# Altium project Antenny_v6.PrjPcb (part 2 of 2)

## Sheet 03_PUSHBUTTON.SchDoc
size A; SheetNumber: 3; SheetTotal: 6
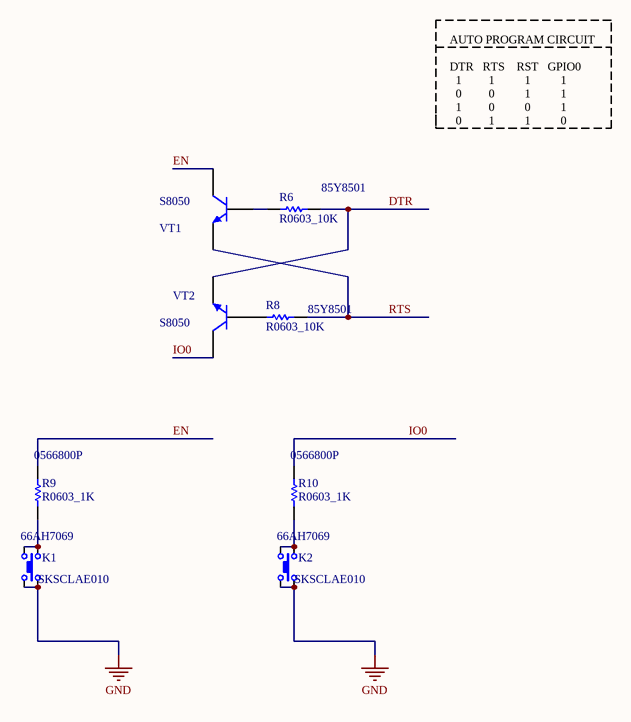
[diagram p2: 03_PUSHBUTTON.SchDoc]

### Parts
K1  SKSCLAE010  Supplier Part Number 1: 66AH7069  [ButtonTACT_3.5*3.55_90]
K2  SKSCLAE010  Supplier Part Number 1: 66AH7069  [ButtonTACT_3.5*3.55_90]
R6  R0603_10K  Supplier Part Number 1: 85Y8501  [RESC1609X55X30LL15T15]
R8  R0603_10K  Supplier Part Number 1: 85Y8501  [RESC1609X55X30LL15T15]
R9  R0603_1K  Supplier Part Number 1: 0566800P  [RESC1609X55X30LL15T15]
R10  R0603_1K  Supplier Part Number 1: 0566800P  [RESC1609X55X30LL15T15]
VT1  S8050  [SMT_TRIODE_NPN]
VT2  S8050  [SMT_TRIODE_NPN]

### Nets
GND: K1.1 K1.3 K2.1 K2.3
DTR: R6.2 VT2.2(E)
EN: R9.2 VT1.3(C)
IO0: R10.2 VT2.3(C)  [project net BOOT_OP0]
RTS: R8.2 VT1.2(E)
NetK1_2: K1.2 K1.4 R9.1
NetK2_2: K2.2 K2.4 R10.1
NetR6_1: R6.1 VT1.1(B)
NetR8_1: R8.1 VT2.1(B)

### Notes on the sheet
- AUTO PROGRAM CIRCUIT
  DTR   RTS    RST   GPIO0
  1         1          1          1
  0         0          1          1
  1         0          0          1
  0         1          1          0

### Library data of the parts
K1 K2 = ButtonTACT: Black Button Tactile Switch, Single Pole Single Throw (SPST) 50 mA 0.65mm Surface Mount; Manufacturer: Alps Electric; value: 3.4x3.5; Operating Force: 2.2N; Max Voltage Rating (DC): 12V; Max Current Rating: 50mA; Contact Resistance: 100mR; Electrical Life: 100000Cycles; type: TACT 4P; Supplier 1: Newark; Manufacturer Part Number: SKSCLAE010; RoHS: Yes; Category: Tactile Switches; Stock 1: 4920; Pricing 1: 10=0.89600, 25=0.76800, 50=0.68700, 100=0.62100 (USD); Mount: Surface Mount; Case/Package: SMD/SMT; Contact Plating: Silver; Min Operating Temperature: -30°C; Max Operating Temperature: 85°C; Throw Configuration: SPST; Termination: Gull Wing; Packaging: Tape and Reel; Voltage Rating (DC): 12V; Current Rating: 50mA; Orientation: Right Angle; Series: SKSC; Length: 4.85mm; Depth: 3.85mm; Actuator Length: 0.65mm; Radiation Hardening: No; Lead Free: Lead Free; RoHS Compliant: Yes; ComponentLink1URL: https://datasheet.ciiva.com/16156/sksc-16156198.pdf?src-supplier=Onlinecomponents.com; ComponentLink1Description: https://datasheet.ciiva.com/16156/sksc-16156198.pdf?src-supplier=Onlinecomponents.com
R6 R8 = R0603: PANASONIC - ERJ-3EKF1002V. - THICK FILM CHIP RES, 0603, 1%, PRECISION; Resistance: 10kR; Power Rating: 100mW; Temperature Coefficient: 100ppm/°C; Voltage Rating: 75V; Supplier 1: Newark; Manufacturer: Panasonic; Manufacturer Part Number: ERJ-3EKF1002V; RoHS: Yes; Category: Chip SMD Resistors; Stock 1: 27295001; Pricing 1: 5000=0.00900, 10000=0.00900 (USD); Mount: Surface Mount; Case/Package: 0603; Number of Pins: 2; Case Code (Metric): 1608; Case Code (Imperial): 0603; Contact Plating: Tin; Size Code: 0603; Min Operating Temperature: -55°C; Max Operating Temperature: 155°C; Packaging: Tape and Reel; Resistor Type: Thick Film; Number of Terminations: 2; Max Power Dissipation: 100mW; Tolerance: 1%; Series: ERJ; Construction: Rectangular; Features: Automotive AEC-Q200; Package Quantity: 1; Voltage Rating (DC): 75V; Termination: SMD/SMT; Resistance Tolerance: 1%; Technology: THICK FILM; Length: 1.6mm; Width: 0.031inch; Height: 0.45mm; Depth: 0.8mm; Radiation Hardening: No; Military Standard: Not; Lead Free: Lead Free; RoHS Compliant: Yes; REACH SVHC: No SVHC; ComponentLink1URL: https://datasheet.ciiva.com/48530/aoa0000ce2-48530988.pdf?src-supplier=Avnet; ComponentLink1Description: https://datasheet.ciiva.com/48530/aoa0000ce2-48530988.pdf?src-supplier=Avnet; ComponentLink2URL: https://datasheet.ciiva.com/24070/aoa0000ce2-24070318.pdf?src-supplier=Mouser; ComponentLink2Description: https://datasheet.ciiva.com/24070/aoa0000ce2-24070318.pdf?src-supplier=Mouser; ComponentLink3URL: https://datasheet.ciiva.com/9194/aoa0000ce2-9194199.pdf?src-supplier=Avnet; ComponentLink3Description: https://datasheet.ciiva.com/9194/aoa0000ce2-9194199.pdf?src-supplier=Avnet; ComponentLink4URL: https://datasheet.ciiva.com/30208/aoa0000ce2-30208985.pdf?src-supplier=Onlinecomponents.com; ComponentLink4Description: https://datasheet.ciiva.com/30208/aoa0000ce2-30208985.pdf?src-supplier=Onlinecomponents.com; ComponentLink5URL: https://datasheet.ciiva.com/16759/70260748-16759807.pdf?src-supplier=Allied+Electronics; ComponentLink5Description: https://datasheet.ciiva.com/16759/70260748-16759807.pdf?src-supplier=Allied+Electronics; ComponentLink6URL: https://datasheet.ciiva.com/7830/aoa0000ce2-7830729.pdf?src-supplier=Element14; ComponentLink6Description: https://datasheet.ciiva.com/7830/aoa0000ce2-7830729.pdf?src-supplier=Element14; ComponentLink7URL: https://datasheet.ciiva.com/28514/426256-28514198.pdf?src-supplier=Element14; ComponentLink7Description: https://datasheet.ciiva.com/28514/426256-28514198.pdf?src-supplier=Element14; ComponentLink8URL: https://datasheet.ciiva.com/46372/1678782-46372725.pdf?src-supplier=Element14; ComponentLink8Description: https://datasheet.ciiva.com/46372/1678782-46372725.pdf?src-supplier=Element14; ComponentLink9URL: https://datasheet.ciiva.com/16511/aoa0000ce2-16511861.pdf?src-supplier=Avnet+Asia; ComponentLink9Description: https://datasheet.ciiva.com/16511/aoa0000ce2-16511861.pdf?src-supplier=Avnet+Asia; ComponentLink10URL: https://datasheet.ciiva.com/17212/aoa0000ce2-17212105.pdf?src-supplier=Avnet+Europe; ComponentLink10Description: https://datasheet.ciiva.com/17212/aoa0000ce2-17212105.pdf?src-supplier=Avnet+Europe
R9 R10 = R0603: Res Thin Film 0603 1K Ohm 0.1% 1/10W ±25ppm/°C Molded SMD SMD Punched Carrier T/R; Manufacturer: Panasonic; Manufacturer Part Number: ERA-3AEB102V; Resistance: 1kR; Power Rating: 100mW; Voltage Rating: 75V; Supplier 1: RSComponents; RoHS: Yes; Category: Chip SMD Resistors; Stock 1: 1; Pricing 1: 5=0.38700, 50=0.32600, 250=0.12700, 1250=0.06600, 2500=0.04700 (USD); Mount: Surface Mount; Case/Package: 0603; Number of Pins: 2; Case Code (Imperial): 0603; Case Code (Metric): 1608; Contact Plating: Tin; Size Code: 0603; Min Operating Temperature: -55°C; Max Operating Temperature: 155°C; Packaging: Tape and Reel; Resistor Type: Thin Film; Temperature Coefficient: 25ppm/°C; Series: ERA-3A; Construction: Rectangular; Tolerance: 0.1%; Number of Terminations: 2; Max Power Dissipation: 100mW; Termination: SMD/SMT; Package Quantity: 5000; Resistance Tolerance: 0.1%; Technology: METAL FILM; Length: 1.6mm; Width: 0.8mm; Height: 0.45mm; Depth: 0.8mm; Radiation Hardening: No; Military Standard: Not; RoHS Compliant: Yes; REACH SVHC: No SVHC; ComponentLink1URL: https://datasheet.ciiva.com/11808/0900766b80fe20f7-11808019.pdf?src-supplier=RSComponents; ComponentLink1Description: https://datasheet.ciiva.com/11808/0900766b80fe20f7-11808019.pdf?src-supplier=RSComponents; ComponentLink2URL: https://datasheet.ciiva.com/29183/450752-da-01-en-widerstand-0603-era-29183754.pdf?src-supplier=Conrad; ComponentLink2Description: https://datasheet.ciiva.com/29183/450752-da-01-en-widerstand-0603-era-29183754.pdf?src-supplier=Conrad; ComponentLink3URL: https://datasheet.ciiva.com/5734/aoa0000ce26-5734524.pdf?src-supplier=Farnell; ComponentLink3Description: https://datasheet.ciiva.com/5734/aoa0000ce26-5734524.pdf?src-supplier=Farnell; ComponentLink4URL: https://datasheet.ciiva.com/5734/485442-5734525.pdf?src-supplier=Farnell; ComponentLink4Description: https://datasheet.ciiva.com/5734/485442-5734525.pdf?src-supplier=Farnell; ComponentLink5URL: https://datasheet.ciiva.com/9198/aoa0000ce26-9198972.pdf?src-supplier=Avnet; ComponentLink5Description: https://datasheet.ciiva.com/9198/aoa0000ce26-9198972.pdf?src-supplier=Avnet; ComponentLink6URL: https://datasheet.ciiva.com/48530/era-eng-tds-48530582.pdf?src-supplier=Distrelec; ComponentLink6Description: https://datasheet.ciiva.com/48530/era-eng-tds-48530582.pdf?src-supplier=Distrelec; ComponentLink7URL: https://datasheet.ciiva.com/24071/aoa0000ce26-197354-24071510.pdf?src-supplier=Mouser; ComponentLink7Description: https://datasheet.ciiva.com/24071/aoa0000ce26-197354-24071510.pdf?src-supplier=Mouser; ComponentLink8URL: https://datasheet.ciiva.com/16853/aoa0000ce26-16853231.pdf?src-supplier=Avnet+Europe; ComponentLink8Description: https://datasheet.ciiva.com/16853/aoa0000ce26-16853231.pdf?src-supplier=Avnet+Europe; ComponentLink9URL: https://datasheet.ciiva.com/16426/aoa0000ce26-16426809.pdf?src-supplier=Future+Electronics; ComponentLink9Description: https://datasheet.ciiva.com/16426/aoa0000ce26-16426809.pdf?src-supplier=Future+Electronics; ComponentLink10URL: https://datasheet.ciiva.com/46393/1776116-46393695.pdf?src-supplier=Element14; ComponentLink10Description: https://datasheet.ciiva.com/46393/1776116-46393695.pdf?src-supplier=Element14; ComponentLink11URL: https://datasheet.ciiva.com/46422/1776116-46422455.pdf?src-supplier=Element14; ComponentLink11Description: https://datasheet.ciiva.com/46422/1776116-46422455.pdf?src-supplier=Element14; ComponentLink12URL: https://datasheet.ciiva.com/46422/485442-46422519.pdf?src-supplier=Element14; ComponentLink12Description: https://datasheet.ciiva.com/46422/485442-46422519.pdf?src-supplier=Element14; ComponentLink13URL: https://datasheet.ciiva.com/28531/485442-28531944.pdf?src-supplier=Element14; ComponentLink13Description: https://datasheet.ciiva.com/28531/485442-28531944.pdf?src-supplier=Element14; ComponentLink14URL: https://datasheet.ciiva.com/16781/70068849-16781703.pdf?src-supplier=Allied+Electronics; ComponentLink14Description: https://datasheet.ciiva.com/16781/70068849-16781703.pdf?src-supplier=Allied+Electronics; ComponentLink15URL: https://datasheet.ciiva.com/16725/70068849-16725038.pdf?src-supplier=Allied+Electronics; ComponentLink15Description: https://datasheet.ciiva.com/16725/70068849-16725038.pdf?src-supplier=Allied+Electronics
VT1 VT2 = SMT_TRIODE_NPN: Surface mount NPN transistor, package SOT-23

## Sheet 04_PWMDRIVER.SchDoc
size A; SheetNumber: 4; SheetTotal: 5
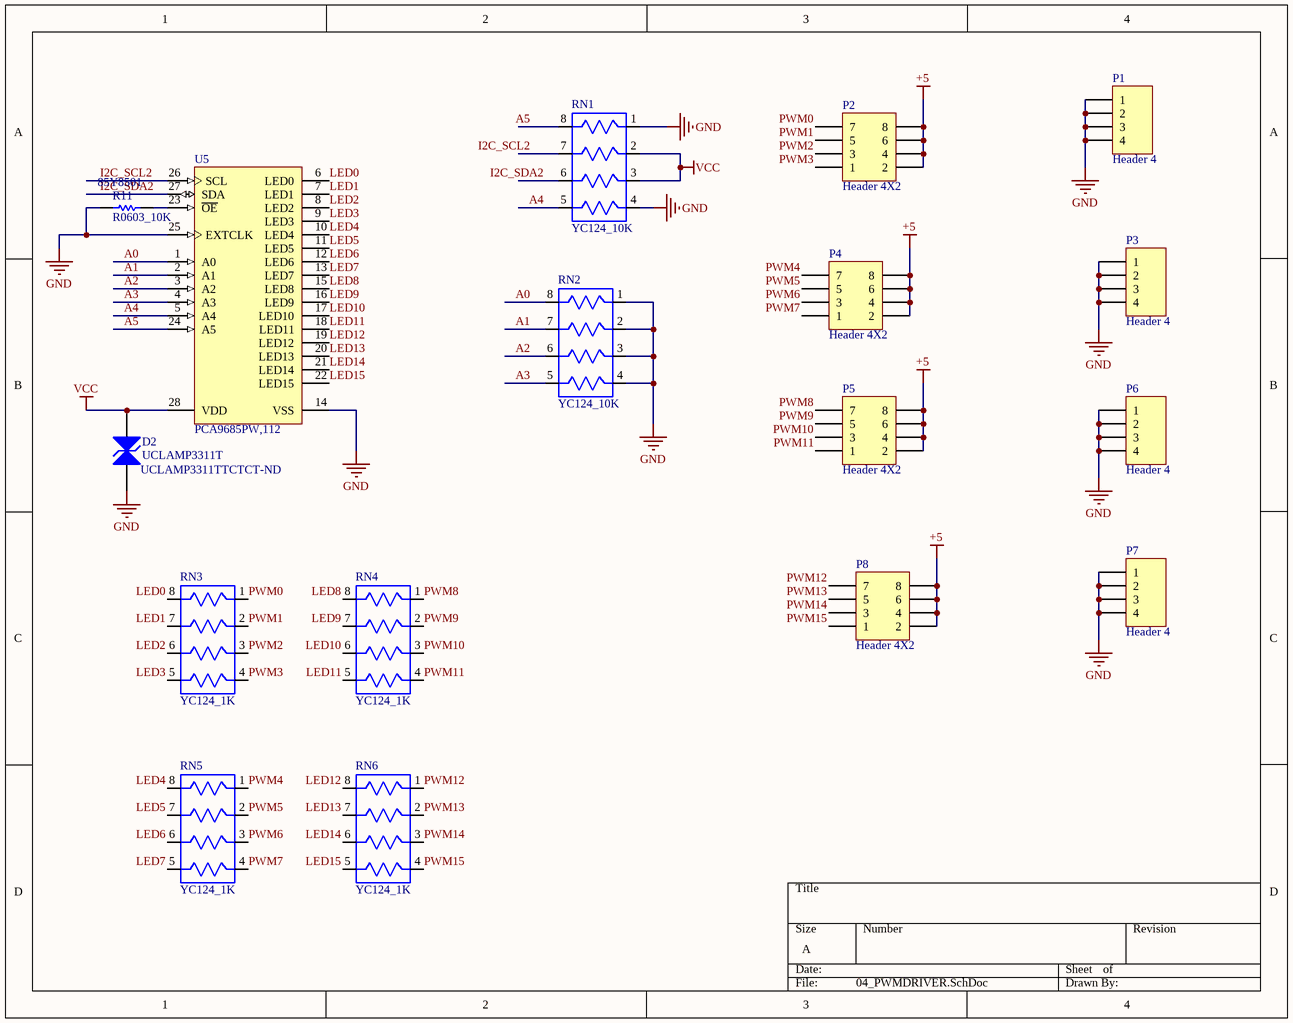
[diagram p3: 04_PWMDRIVER.SchDoc]

### Parts
D2  UCLAMP3311T  Supplier Part Number 1: UCLAMP3311TTCTCT-ND  [SEMT-SLP1006P2-2_V]
P1  Header 4  [HDR1X4]
P2  Header 4X2  [HDR2X4]
P3  Header 4  [HDR1X4]
P4  Header 4X2  [HDR2X4]
P5  Header 4X2  [HDR2X4]
P6  Header 4  [HDR1X4]
P7  Header 4  [HDR1X4]
P8  Header 4X2  [HDR2X4]
R11  R0603_10K  Supplier Part Number 1: 85Y8501  [RESC1609X55X30LL15T15]
RN1  YC124_10K  [YC124]
RN2  YC124_10K  [YC124]
RN3  YC124_1K  [YC124]
RN4  YC124_1K  [YC124]
RN5  YC124_1K  [YC124]
RN6  YC124_1K  [YC124]
U5  PCA9685PW,112  [SOT361-1_V]

### Nets
+5: P2.2 P2.4 P2.6 P2.8 P4.2 P4.4 P4.6 P4.8 P5.2 P5.4 P5.6 P5.8 P8.2 P8.4 P8.6 P8.8
GND: D2.1(A) P1.1 P1.2 P1.3 P1.4 P3.1 P3.2 P3.3 P3.4 P6.1 P6.2 P6.3 P6.4 P7.1 P7.2 P7.3 P7.4 R11.1 RN1.1 RN1.4 RN2.1 RN2.2 RN2.3 RN2.4 U5.14(VSS) U5.25(EXTCLK)
VCC: D2.2(A) RN1.2 RN1.3 U5.28(VDD)
A0: RN2.8 U5.1(A0)
A1: RN2.7 U5.2(A1)
A2: RN2.6 U5.3(A2)
A3: RN2.5 U5.4(A3)
A4: RN1.5 U5.5(A4)
A5: RN1.8 U5.24(A5)
I2C_SCL2: RN1.7 U5.26(SCL)
I2C_SDA2: RN1.6 U5.27(SDA)
LED0: RN3.8 U5.6(LED0)
LED1: RN3.7 U5.7(LED1)
LED2: RN3.6 U5.8(LED2)
LED3: RN3.5 U5.9(LED3)
LED4: RN5.8 U5.10(LED4)
LED5: RN5.7 U5.11(LED5)
LED6: RN5.6 U5.12(LED6)
LED7: RN5.5 U5.13(LED7)
LED8: RN4.8 U5.15(LED8)
LED9: RN4.7 U5.16(LED9)
LED10: RN4.6 U5.17(LED10)
LED11: RN4.5 U5.18(LED11)
LED12: RN6.8 U5.19(LED12)
LED13: RN6.7 U5.20(LED13)
LED14: RN6.6 U5.21(LED14)
LED15: RN6.5 U5.22(LED15)
PWM0: P2.7 RN3.1
PWM1: P2.5 RN3.2
PWM2: P2.3 RN3.3
PWM3: P2.1 RN3.4
PWM4: P4.7 RN5.1
PWM5: P4.5 RN5.2
PWM6: P4.3 RN5.3
PWM7: P4.1 RN5.4
PWM8: P5.7 RN4.1
PWM9: P5.5 RN4.2
PWM10: P5.3 RN4.3
PWM11: P5.1 RN4.4
PWM12: P8.7 RN6.1
PWM13: P8.5 RN6.2
PWM14: P8.3 RN6.3
PWM15: P8.1 RN6.4
NetR11_2: R11.2 U5.23(~{OE})

### Library data of the parts
D2 = TVS_CLAMP: SEMTECH - UCLAMP3311T.TCT - TVS ARRAY, 40W, 3.3V, BI-DIRECTIONAL, SLP1006P2T; Direction: Bidirectional; Clamping Voltage: 8V; Element Configuration: Single; Number of Bidirectional Channels: 1; Min Breakdown Voltage: 3.5V; Power Line Protection: No; Leakage Current: 50nA; Peak Pulse Current: 5A; Diode Type: ZENER; Supplier 1: Digi-Key; Manufacturer: Semtech; Manufacturer Part Number: UCLAMP3311T.TCT; RoHS: Yes; Category: TVS Diodes; Stock 1: 13131; Pricing 1: 1=0.74000, 10=0.65300, 100=0.50090, 500=0.39600, 1000=0.31680 (USD); Mount: Surface Mount; Case/Package: 0402; Number of Pins: 2; Case Code (Metric): 1006; Case Code (Imperial): 0402; Min Operating Temperature: -40°C; Max Operating Temperature: 85°C; Working Voltage: 3.3V; Packaging: Tape and Reel; Reverse Standoff Voltage: 3.3V; Peak Pulse Power: 40W; Resistor Type: Zener; Series: uClamp®; Length: 1mm; Depth: 0.6mm; Radiation Hardening: No; RoHS Compliant: Yes; ComponentLink1URL: https://datasheet.ciiva.com/25956/uclamp3311t-25956948.pdf?src-supplier=Avnet+Europe; ComponentLink1Description: https://datasheet.ciiva.com/25956/uclamp3311t-25956948.pdf?src-supplier=Avnet+Europe; ComponentLink2URL: https://datasheet.ciiva.com/11195/uclamp3311t-11195117.pdf?src-supplier=Avnet; ComponentLink2Description: https://datasheet.ciiva.com/11195/uclamp3311t-11195117.pdf?src-supplier=Avnet; ComponentLink3URL: https://datasheet.ciiva.com/29588/uclamp3311t-29588805.pdf?src-supplier=Digi-Key; ComponentLink3Description: https://datasheet.ciiva.com/29588/uclamp3311t-29588805.pdf?src-supplier=Digi-Key; ComponentLink4URL: https://datasheet.ciiva.com/29588/uclamp3311t-29588806.pdf?src-supplier=Digi-Key; ComponentLink4Description: https://datasheet.ciiva.com/29588/uclamp3311t-29588806.pdf?src-supplier=Digi-Key; ComponentLink5URL: https://datasheet.ciiva.com/29588/uclamp3311t-29588807.pdf?src-supplier=Digi-Key; ComponentLink5Description: https://datasheet.ciiva.com/29588/uclamp3311t-29588807.pdf?src-supplier=Digi-Key
P1 P3 P6 P7 = Header 4: Header, 4-Pin; LatestRevisionDate: 17-Jul-2002; LatestRevisionNote: Re-released for DXP Platform.; Publisher: Altium Limited
P2 P4 P5 P8 = Header 4X2: Header, 4-Pin, Dual row; LatestRevisionDate: 17-Jul-2002; LatestRevisionNote: Re-released for DXP Platform.; Publisher: Altium Limited
R11 = R0603: as R6 on sheet 03_PUSHBUTTON; Supplier 1: Newark; Manufacturer: Panasonic; Manufacturer Part Number: ERJ-3EKF1002V; RoHS: Yes; Category: Chip SMD Resistors; Stock 1: 27295001; Pricing 1: 5000=0.00900, 10000=0.00900 (USD); Mount: Surface Mount; Case/Package: 0603; Number of Pins: 2; Case Code (Metric): 1608; Case Code (Imperial): 0603; Contact Plating: Tin; Size Code: 0603; Min Operating Temperature: -55°C; Max Operating Temperature: 155°C; Packaging: Tape and Reel; Resistor Type: Thick Film; Number of Terminations: 2; Max Power Dissipation: 100mW; Tolerance: 1%; Series: ERJ; Construction: Rectangular; Features: Automotive AEC-Q200; Package Quantity: 1; Voltage Rating (DC): 75V; Termination: SMD/SMT; Resistance Tolerance: 1%; Technology: THICK FILM; Length: 1.6mm; Width: 0.031inch; Height: 0.45mm; Depth: 0.8mm; Radiation Hardening: No; Military Standard: Not; Lead Free: Lead Free; RoHS Compliant: Yes; REACH SVHC: No SVHC; ComponentLink1URL: https://datasheet.ciiva.com/48530/aoa0000ce2-48530988.pdf?src-supplier=Avnet; ComponentLink1Description: https://datasheet.ciiva.com/48530/aoa0000ce2-48530988.pdf?src-supplier=Avnet; ComponentLink2URL: https://datasheet.ciiva.com/24070/aoa0000ce2-24070318.pdf?src-supplier=Mouser; ComponentLink2Description: https://datasheet.ciiva.com/24070/aoa0000ce2-24070318.pdf?src-supplier=Mouser; ComponentLink3URL: https://datasheet.ciiva.com/9194/aoa0000ce2-9194199.pdf?src-supplier=Avnet; ComponentLink3Description: https://datasheet.ciiva.com/9194/aoa0000ce2-9194199.pdf?src-supplier=Avnet; ComponentLink4URL: https://datasheet.ciiva.com/30208/aoa0000ce2-30208985.pdf?src-supplier=Onlinecomponents.com; ComponentLink4Description: https://datasheet.ciiva.com/30208/aoa0000ce2-30208985.pdf?src-supplier=Onlinecomponents.com; ComponentLink5URL: https://datasheet.ciiva.com/16759/70260748-16759807.pdf?src-supplier=Allied+Electronics; ComponentLink5Description: https://datasheet.ciiva.com/16759/70260748-16759807.pdf?src-supplier=Allied+Electronics; ComponentLink6URL: https://datasheet.ciiva.com/7830/aoa0000ce2-7830729.pdf?src-supplier=Element14; ComponentLink6Description: https://datasheet.ciiva.com/7830/aoa0000ce2-7830729.pdf?src-supplier=Element14; ComponentLink7URL: https://datasheet.ciiva.com/28514/426256-28514198.pdf?src-supplier=Element14; ComponentLink7Description: https://datasheet.ciiva.com/28514/426256-28514198.pdf?src-supplier=Element14; ComponentLink8URL: https://datasheet.ciiva.com/46372/1678782-46372725.pdf?src-supplier=Element14; ComponentLink8Description: https://datasheet.ciiva.com/46372/1678782-46372725.pdf?src-supplier=Element14; ComponentLink9URL: https://datasheet.ciiva.com/16511/aoa0000ce2-16511861.pdf?src-supplier=Avnet+Asia; ComponentLink9Description: https://datasheet.ciiva.com/16511/aoa0000ce2-16511861.pdf?src-supplier=Avnet+Asia; ComponentLink10URL: https://datasheet.ciiva.com/17212/aoa0000ce2-17212105.pdf?src-supplier=Avnet+Europe; ComponentLink10Description: https://datasheet.ciiva.com/17212/aoa0000ce2-17212105.pdf?src-supplier=Avnet+Europe
RN1-RN6 = YC124
U5 = CMP-1595-00004-2: 16-Channel, 12-Bit PWM Fm+ I2C-Bus LED Controller, 2.3 to 5.5 V, -40 to 85 degC, 28-Pin TSSOP (SOT361-1), RoHS, Tape and Reel; Supply Current Max: 10 mA; Supply Voltage Min: 2.3 V; Supply Voltage Max: 5.5 V; Frequency: 25000000 Hz; Temperature Min: -40 degC; PackageDescription: 28-Pin Small Outline Package, Body 9.7 x 4.4 mm, Pitch 0.65 mm; RoHS: TRUE; ComponentLink1Description: Manufacturer URL; Code_JEDEC: MO-153; PartNumber: PCA9685; ComponentLink2URL: http://www.nxp.com/documents/data_sheet/PCA9685.pdf; Packing: Tape and Reel; ComponentLink1URL: http://www.nxp.com/; ComponentLink3Description: Package Specification; ComponentLink2Description: Datasheet; ComponentLink3URL: http://www.nxp.com/documents/outline_drawing/sot361-1_po.pdf; DatasheetVersion: Rev. 4; Temperature Max: 85 degC; PackageVersion: 02/2003; Mounting Technology: Surface Mount

## Sheet 05_ESP32.SchDoc
size 420 x 297 mm; SheetNumber: 5; SheetTotal: 6
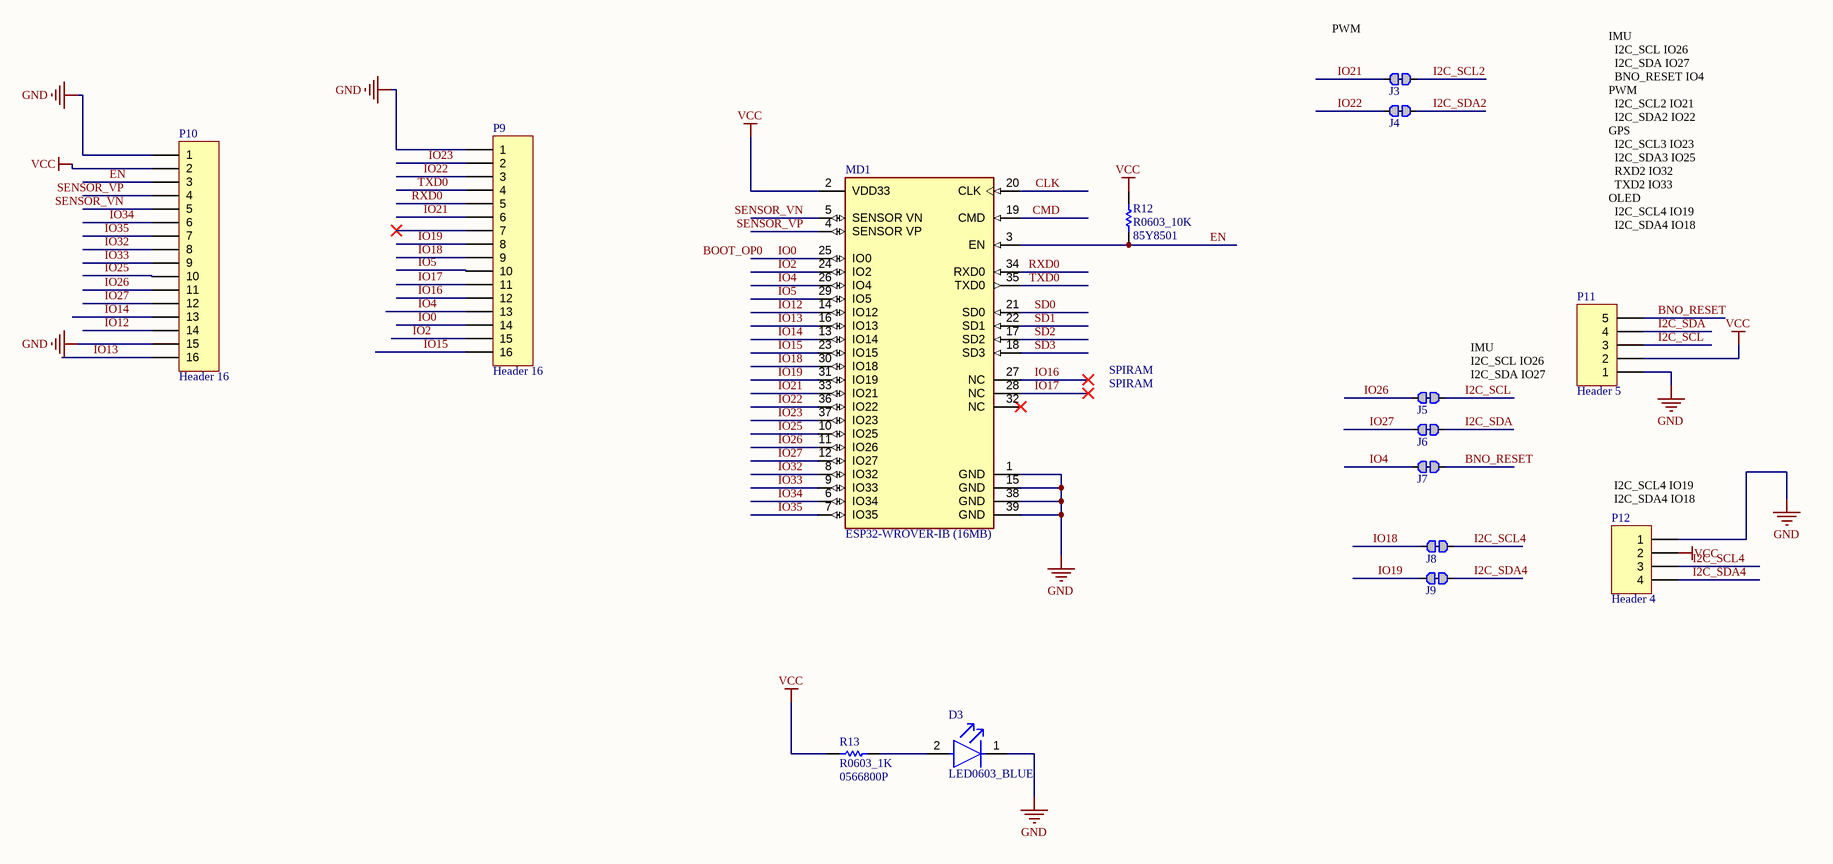
[diagram p4: 05_ESP32.SchDoc]

### Parts
D3  LED0603_BLUE  [FP-LTST-C191TBKT-MFG]
J3  Jumper  [0402-0R]  (value not drawn)
J4  Jumper  [0402-0R]  (value not drawn)
J5  Jumper  [0402-0R]  (value not drawn)
J6  Jumper  [0402-0R]  (value not drawn)
J7  Jumper  [0402-0R]  (value not drawn)
J8  Jumper  [0402-0R]  (value not drawn)
J9  Jumper  [0402-0R]  (value not drawn)
MD1  ESP32-WROVER-IB (16MB)  [FP-ESP32-WROVER-MFG]
P9  Header 16  [HDR1X16]
P10  Header 16  [HDR1X16]
P11  Header 5  [HDR1X5]
P12  Header 4  [HDR1X4]
R12  R0603_10K  Supplier Part Number 1: 85Y8501  [RESC1609X55X30LL15T15]
R13  R0603_1K  Supplier Part Number 1: 0566800P  [RESC1609X55X30LL15T15]

### Nets
GND: D3.1(C) MD1.1(GND) MD1.15(GND) MD1.38(GND) MD1.39(GND) P9.1 P10.1 P10.15 P11.1 P12.1
VCC: MD1.2(VDD33) P10.2 P11.2 P12.2 R12.2 R13.2
BNO_RESET: J7.2 P11.5
BOOT_OP0: MD1.25(IO0) P9.14  [also labelled IO0]
CLK: MD1.20(CLK)
CMD: MD1.19(CMD)
EN: MD1.3(EN) P10.3 R12.1
I2C_SCL: J5.2 P11.3
I2C_SCL2: J3.2
I2C_SCL4: J8.2 P12.3
I2C_SDA: J6.2 P11.4
I2C_SDA2: J4.2
I2C_SDA4: J9.2 P12.4
IO2: MD1.24(IO2) P9.15
IO4: J7.1 MD1.26(IO4) P9.13
IO5: MD1.29(IO5) P9.10
IO12: MD1.14(IO12) P10.14
IO13: MD1.16(IO13) P10.16
IO14: MD1.13(IO14) P10.13
IO15: MD1.23(IO15) P9.16
IO16: MD1.27(NC) P9.12
IO17: MD1.28(NC) P9.11
IO18: J8.1 MD1.30(IO18) P9.9
IO19: J9.1 MD1.31(IO19) P9.8
IO21: J3.1 MD1.33(IO21) P9.6
IO22: J4.1 MD1.36(IO22) P9.3
IO23: MD1.37(IO23) P9.2
IO25: MD1.10(IO25) P10.10
IO26: J5.1 MD1.11(IO26) P10.11
IO27: J6.1 MD1.12(IO27) P10.12
IO32: MD1.8(IO32) P10.8
IO33: MD1.9(IO33) P10.9
IO34: MD1.6(IO34) P10.6
IO35: MD1.7(IO35) P10.7
RXD0: MD1.34(RXD0) P9.5
SD0: MD1.21(SD0)
SD1: MD1.22(SD1)
SD2: MD1.17(SD2)
SD3: MD1.18(SD3)
SENSOR_VN: MD1.5(SENSOR_VN) P10.5
SENSOR_VP: MD1.4(SENSOR_VP) P10.4
TXD0: MD1.35(TXD0) P9.4
NetD3_2: D3.2(A) R13.1

Not connected (* = marked no-connect by the designer): MD1 32(NC)*; P9 7*

### Notes on the sheet
- (near J3) PWM
- IMU
  I2C_SCL IO26
  I2C_SDA IO27
  BNO_RESET IO4
  PWM
  I2C_SCL2 IO21
  I2C_SDA2 IO22
  GPS
  I2C_SCL3 IO23
  I2C_SDA3 IO25
  RXD2 IO32
  TXD2 IO33
  OLED
  I2C_SCL4 IO19
  I2C_SDA4 IO18
- SPIRAM
- IMU
  I2C_SCL IO26
  I2C_SDA IO27
- (near P12) I2C_SCL4 IO19
  I2C_SDA4 IO18

### Library data of the parts
D3 = CMP-22017-000008-1: LED BLUE CLEAR CHIP SMD; Lens Color: Colorless; Dominant Wavelength: 475nm; Forward Current: 20mA; Wavelength: 468nm; Viewing Angle: 130°; Power Dissipation: 76mW; Luminous Intensity: 180mcd; Reverse Voltage: 5V; Number of Elements: 1; Lens Style: Diffused; Forward Voltage: 3.8V; Max Power Dissipation: 75mW; Case Code (Metric): 1608; Packaging: Tape and Reel; Case/Package: 0603; Depth: 1.6mm; Mount: Surface Mount; Lead Free: Lead Free; Min Operating Temperature: -20°C; Lens Transparency: Clear; Illumination Color: Blue; Height: 0.55mm; Test Current: 20mA; Case Code (Imperial): 0603; Max Operating Temperature: 80°C; Number of Pins: 2; Length: 0.8mm; Radiation Hardening: No; Package Quantity: 1; Number of LEDs: 1; Width: 0.8mm; Color: Blue
J3-J9 = Jumper: Resistor
MD1 = CMP-194065-000005-1: SMD MODULE, ESP32-D0WDQ6; Manufacturer: Espressif Systems; Interface: I2C,SPI,UART,I2S,Other; Number Of Adc Channels: 16; Data Rate: 150Mbits/s; Number Of Gpio: 20; Sensitivity: -98dBm; Max Frequency: 2.5GHz; Bandwidth: 0.1GHz; Max Supply Voltage: 3.6V; Min Supply Voltage: 2.3V; Nominal Supply Current: 80mA; Height: 3.4mm; Device Class L3: Transceivers; Octopart: https://octopart.com/esp32-wrover-espressif+systems-89171348; Device Class L2: RF Semiconductors and Devices; ComponentLink2Description: Datasheet; RoHS: TRUE; Lead Free: Yes; Device Class L1: Integrated Circuits (ICs); Temperature Range High: +85°C; Digikey Description: SMD MODULE, ESP32-D0WDQ6, 32MBIT; Package: ESP32-WROVER; Mouser Description: Bluetooth and Wi-Fi Module 2.4GHz to 2.5GHz 2.3V to 3.6V 38-Pin SMD Module; Temperature: -40°C to +85°C; Category: UNK; Manufacturer Part Number: ESP32-WROVER; Automotive: No; Temperature Range Low: -40°C; ComponentLink2URL: https://forum.upverter.com/uploads/default/original/3X/1/9/19ab4f33dd815ce1b2b0bb210f0ab7d5aab1dea3.pdf
P9 P10 = Header 16: Header, 16-Pin; LatestRevisionDate: 17-Jul-2002; LatestRevisionNote: Re-released for DXP Platform.; Publisher: Altium Limited
P11 = Header 5: Header, 5-Pin; LatestRevisionDate: 17-Jul-2002; LatestRevisionNote: Re-released for DXP Platform.; Publisher: Altium Limited
P12 = Header 4: Header, 4-Pin; LatestRevisionDate: 17-Jul-2002; LatestRevisionNote: Re-released for DXP Platform.; Publisher: Altium Limited
R12 = R0603: as R6 on sheet 03_PUSHBUTTON; Supplier 1: Newark; Manufacturer: Panasonic; Manufacturer Part Number: ERJ-3EKF1002V; RoHS: Yes; Category: Chip SMD Resistors; Stock 1: 27295001; Pricing 1: 5000=0.00900, 10000=0.00900 (USD); Mount: Surface Mount; Case/Package: 0603; Number of Pins: 2; Case Code (Metric): 1608; Case Code (Imperial): 0603; Contact Plating: Tin; Size Code: 0603; Min Operating Temperature: -55°C; Max Operating Temperature: 155°C; Packaging: Tape and Reel; Resistor Type: Thick Film; Number of Terminations: 2; Max Power Dissipation: 100mW; Tolerance: 1%; Series: ERJ; Construction: Rectangular; Features: Automotive AEC-Q200; Package Quantity: 1; Voltage Rating (DC): 75V; Termination: SMD/SMT; Resistance Tolerance: 1%; Technology: THICK FILM; Length: 1.6mm; Width: 0.031inch; Height: 0.45mm; Depth: 0.8mm; Radiation Hardening: No; Military Standard: Not; Lead Free: Lead Free; RoHS Compliant: Yes; REACH SVHC: No SVHC; ComponentLink1URL: https://datasheet.ciiva.com/48530/aoa0000ce2-48530988.pdf?src-supplier=Avnet; ComponentLink1Description: https://datasheet.ciiva.com/48530/aoa0000ce2-48530988.pdf?src-supplier=Avnet; ComponentLink2URL: https://datasheet.ciiva.com/24070/aoa0000ce2-24070318.pdf?src-supplier=Mouser; ComponentLink2Description: https://datasheet.ciiva.com/24070/aoa0000ce2-24070318.pdf?src-supplier=Mouser; ComponentLink3URL: https://datasheet.ciiva.com/9194/aoa0000ce2-9194199.pdf?src-supplier=Avnet; ComponentLink3Description: https://datasheet.ciiva.com/9194/aoa0000ce2-9194199.pdf?src-supplier=Avnet; ComponentLink4URL: https://datasheet.ciiva.com/30208/aoa0000ce2-30208985.pdf?src-supplier=Onlinecomponents.com; ComponentLink4Description: https://datasheet.ciiva.com/30208/aoa0000ce2-30208985.pdf?src-supplier=Onlinecomponents.com; ComponentLink5URL: https://datasheet.ciiva.com/16759/70260748-16759807.pdf?src-supplier=Allied+Electronics; ComponentLink5Description: https://datasheet.ciiva.com/16759/70260748-16759807.pdf?src-supplier=Allied+Electronics; ComponentLink6URL: https://datasheet.ciiva.com/7830/aoa0000ce2-7830729.pdf?src-supplier=Element14; ComponentLink6Description: https://datasheet.ciiva.com/7830/aoa0000ce2-7830729.pdf?src-supplier=Element14; ComponentLink7URL: https://datasheet.ciiva.com/28514/426256-28514198.pdf?src-supplier=Element14; ComponentLink7Description: https://datasheet.ciiva.com/28514/426256-28514198.pdf?src-supplier=Element14; ComponentLink8URL: https://datasheet.ciiva.com/46372/1678782-46372725.pdf?src-supplier=Element14; ComponentLink8Description: https://datasheet.ciiva.com/46372/1678782-46372725.pdf?src-supplier=Element14; ComponentLink9URL: https://datasheet.ciiva.com/16511/aoa0000ce2-16511861.pdf?src-supplier=Avnet+Asia; ComponentLink9Description: https://datasheet.ciiva.com/16511/aoa0000ce2-16511861.pdf?src-supplier=Avnet+Asia; ComponentLink10URL: https://datasheet.ciiva.com/17212/aoa0000ce2-17212105.pdf?src-supplier=Avnet+Europe; ComponentLink10Description: https://datasheet.ciiva.com/17212/aoa0000ce2-17212105.pdf?src-supplier=Avnet+Europe
R13 = R0603: as R9 on sheet 03_PUSHBUTTON; Supplier 1: RSComponents; RoHS: Yes; Category: Chip SMD Resistors; Stock 1: 1; Pricing 1: 5=0.38700, 50=0.32600, 250=0.12700, 1250=0.06600, 2500=0.04700 (USD); Mount: Surface Mount; Case/Package: 0603; Number of Pins: 2; Case Code (Imperial): 0603; Case Code (Metric): 1608; Contact Plating: Tin; Size Code: 0603; Min Operating Temperature: -55°C; Max Operating Temperature: 155°C; Packaging: Tape and Reel; Resistor Type: Thin Film; Temperature Coefficient: 25ppm/°C; Series: ERA-3A; Construction: Rectangular; Tolerance: 0.1%; Number of Terminations: 2; Max Power Dissipation: 100mW; Termination: SMD/SMT; Package Quantity: 5000; Resistance Tolerance: 0.1%; Technology: METAL FILM; Length: 1.6mm; Width: 0.8mm; Height: 0.45mm; Depth: 0.8mm; Radiation Hardening: No; Military Standard: Not; RoHS Compliant: Yes; REACH SVHC: No SVHC; ComponentLink1URL: https://datasheet.ciiva.com/11808/0900766b80fe20f7-11808019.pdf?src-supplier=RSComponents; ComponentLink1Description: https://datasheet.ciiva.com/11808/0900766b80fe20f7-11808019.pdf?src-supplier=RSComponents; ComponentLink2URL: https://datasheet.ciiva.com/29183/450752-da-01-en-widerstand-0603-era-29183754.pdf?src-supplier=Conrad; ComponentLink2Description: https://datasheet.ciiva.com/29183/450752-da-01-en-widerstand-0603-era-29183754.pdf?src-supplier=Conrad; ComponentLink3URL: https://datasheet.ciiva.com/5734/aoa0000ce26-5734524.pdf?src-supplier=Farnell; ComponentLink3Description: https://datasheet.ciiva.com/5734/aoa0000ce26-5734524.pdf?src-supplier=Farnell; ComponentLink4URL: https://datasheet.ciiva.com/5734/485442-5734525.pdf?src-supplier=Farnell; ComponentLink4Description: https://datasheet.ciiva.com/5734/485442-5734525.pdf?src-supplier=Farnell; ComponentLink5URL: https://datasheet.ciiva.com/9198/aoa0000ce26-9198972.pdf?src-supplier=Avnet; ComponentLink5Description: https://datasheet.ciiva.com/9198/aoa0000ce26-9198972.pdf?src-supplier=Avnet; ComponentLink6URL: https://datasheet.ciiva.com/48530/era-eng-tds-48530582.pdf?src-supplier=Distrelec; ComponentLink6Description: https://datasheet.ciiva.com/48530/era-eng-tds-48530582.pdf?src-supplier=Distrelec; ComponentLink7URL: https://datasheet.ciiva.com/24071/aoa0000ce26-197354-24071510.pdf?src-supplier=Mouser; ComponentLink7Description: https://datasheet.ciiva.com/24071/aoa0000ce26-197354-24071510.pdf?src-supplier=Mouser; ComponentLink8URL: https://datasheet.ciiva.com/16853/aoa0000ce26-16853231.pdf?src-supplier=Avnet+Europe; ComponentLink8Description: https://datasheet.ciiva.com/16853/aoa0000ce26-16853231.pdf?src-supplier=Avnet+Europe; ComponentLink9URL: https://datasheet.ciiva.com/16426/aoa0000ce26-16426809.pdf?src-supplier=Future+Electronics; ComponentLink9Description: https://datasheet.ciiva.com/16426/aoa0000ce26-16426809.pdf?src-supplier=Future+Electronics; ComponentLink10URL: https://datasheet.ciiva.com/46393/1776116-46393695.pdf?src-supplier=Element14; ComponentLink10Description: https://datasheet.ciiva.com/46393/1776116-46393695.pdf?src-supplier=Element14; ComponentLink11URL: https://datasheet.ciiva.com/46422/1776116-46422455.pdf?src-supplier=Element14; ComponentLink11Description: https://datasheet.ciiva.com/46422/1776116-46422455.pdf?src-supplier=Element14; ComponentLink12URL: https://datasheet.ciiva.com/46422/485442-46422519.pdf?src-supplier=Element14; ComponentLink12Description: https://datasheet.ciiva.com/46422/485442-46422519.pdf?src-supplier=Element14; ComponentLink13URL: https://datasheet.ciiva.com/28531/485442-28531944.pdf?src-supplier=Element14; ComponentLink13Description: https://datasheet.ciiva.com/28531/485442-28531944.pdf?src-supplier=Element14; ComponentLink14URL: https://datasheet.ciiva.com/16781/70068849-16781703.pdf?src-supplier=Allied+Electronics; ComponentLink14Description: https://datasheet.ciiva.com/16781/70068849-16781703.pdf?src-supplier=Allied+Electronics; ComponentLink15URL: https://datasheet.ciiva.com/16725/70068849-16725038.pdf?src-supplier=Allied+Electronics; ComponentLink15Description: https://datasheet.ciiva.com/16725/70068849-16725038.pdf?src-supplier=Allied+Electronics

## Sheet 06_LED_ARRAY.SchDoc
size A; SheetNumber: 6; SheetTotal: 6
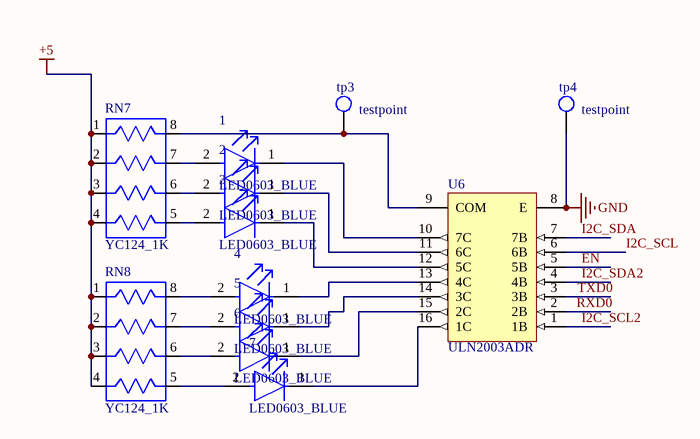
[diagram p5: 06_LED_ARRAY.SchDoc]

### Parts
1  LED0603_BLUE  [FP-LTST-C191TBKT-MFG]
2  LED0603_BLUE  [FP-LTST-C191TBKT-MFG]
3  LED0603_BLUE  [FP-LTST-C191TBKT-MFG]
4  LED0603_BLUE  [FP-LTST-C191TBKT-MFG]
5  LED0603_BLUE  [FP-LTST-C191TBKT-MFG]
6  LED0603_BLUE  [FP-LTST-C191TBKT-MFG]
7  LED0603_BLUE  [FP-LTST-C191TBKT-MFG]
RN7  YC124_1K  [YC124]
RN8  YC124_1K  [YC124]
tp3  testpoint  [testpoint_1mm]
tp4  testpoint  [testpoint_1mm]
U6  ULN2003ADR  [D0016A_M]

### Nets
+5: RN7.1 RN7.2 RN7.3 RN7.4 RN8.1 RN8.2 RN8.3 RN8.4
GND: tp4.1 U6.8(E)
EN: U6.5(5B)
I2C_SCL: U6.6(6B)
I2C_SCL2: U6.1(1B)
I2C_SDA: U6.7(7B)
I2C_SDA2: U6.4(4B)
RXD0: U6.2(2B)
TXD0: U6.3(3B)
Net1_1: 1.1(C) U6.10(7C)
Net1_2: 1.2(A) RN7.7
Net2_1: 2.1(C) U6.11(6C)
Net2_2: 2.2(A) RN7.6
Net3_1: 3.1(C) U6.12(5C)
Net3_2: 3.2(A) RN7.5
Net4_1: 4.1(C) U6.13(4C)
Net4_2: 4.2(A) RN8.8
Net5_1: 5.1(C) U6.14(3C)
Net5_2: 5.2(A) RN8.7
Net6_1: 6.1(C) U6.15(2C)
Net6_2: 6.2(A) RN8.6
Net7_1: 7.1(C) U6.16(1C)
Net7_2: 7.2(A) RN8.5
NetRN7_8: RN7.8 tp3.1 U6.9(COM)

### Library data of the parts
1-7 = CMP-22017-000008-1: as D3 on sheet 05_ESP32; Case Code (Metric): 1608; Packaging: Tape and Reel; Case/Package: 0603; Depth: 1.6mm; Mount: Surface Mount; Lead Free: Lead Free; Min Operating Temperature: -20°C; Lens Transparency: Clear; Illumination Color: Blue; Height: 0.55mm; Test Current: 20mA; Case Code (Imperial): 0603; Max Operating Temperature: 80°C; Number of Pins: 2; Length: 0.8mm; Radiation Hardening: No; Package Quantity: 1; Number of LEDs: 1; Width: 0.8mm; Color: Blue
RN7 RN8 = YC124
U6 = CMP-2000-04953-1: High-Voltage, High-Current Darlington Transistor Array, 0.5 A, 50 V, -20 to 70 degC, 16-Pin SOIC (D), Green (RoHS & no Sb/Br), Tape and Reel; Manufacturer: TexasInstruments; Peak DC Collector Current: 0.5A; Package Version: 4040047-6/M, 06/2011; Maximum Collector Emitter Voltage: 50V; Configuration: Array7; Maximum Collector Emitter Saturation Voltage: 1.1@100mA; Rad Hard: No; Packaging: Tape&Reel; Datasheet URL: http://www.ti.com/general/docs/lit/getliterature.tsp?genericPartNumber=uln2003a&fileType=pdf; Package Reference: D16; Category: DarlingtonBJT; Datasheet Version: Rev. O, 01/2016; Manufacturer URL: http://www.ti.com/; Type: NPN; Package Description: 16-Pin Plastic Small Outline, Body 9.9 x 3.9 mm, Pitch 1.27 mm; Mounting: SurfaceMount; Package: 16SOIC; Package URL: http://www.ti.com/lit/ml/mpds178g/mpds178g.pdf

## Nets that join several sheets
+5: 01_POWER_SUPPLY (8 pins), 02_USB2UART (D1.4 J2.1 R7.1), 04_PWMDRIVER (16 pins), 06_LED_ARRAY (8 pins)
GND: 01_POWER_SUPPLY (14 pins), 02_USB2UART (15 pins), 03_PUSHBUTTON (K1.1 K1.3 K2.1 K2.3), 04_PWMDRIVER (26 pins), 05_ESP32 (10 pins), 06_LED_ARRAY (tp4.1 U6.8)
VCC: 01_POWER_SUPPLY (C7.1 U2.3), 02_USB2UART (6 pins), 04_PWMDRIVER (D2.2 RN1.2 RN1.3 U5.28), 05_ESP32 (6 pins)
BOOT_OP0: 03_PUSHBUTTON (R10.2 VT2.3), 05_ESP32 (MD1.25 P9.14)
DTR: 02_USB2UART (U3.23), 03_PUSHBUTTON (R6.2 VT2.2)
EN: 03_PUSHBUTTON (R9.2 VT1.3), 05_ESP32 (MD1.3 P10.3 R12.1), 06_LED_ARRAY (U6.5)
I2C_SCL: 05_ESP32 (J5.2 P11.3), 06_LED_ARRAY (U6.6)
I2C_SCL2: 04_PWMDRIVER (RN1.7 U5.26), 05_ESP32 (J3.2), 06_LED_ARRAY (U6.1)
I2C_SDA: 05_ESP32 (J6.2 P11.4), 06_LED_ARRAY (U6.7)
I2C_SDA2: 04_PWMDRIVER (RN1.6 U5.27), 05_ESP32 (J4.2), 06_LED_ARRAY (U6.4)
RTS: 02_USB2UART (U3.19), 03_PUSHBUTTON (R8.2 VT1.2)
RXD0: 02_USB2UART (U3.21), 05_ESP32 (MD1.34 P9.5), 06_LED_ARRAY (U6.2)
TXD0: 02_USB2UART (U3.20), 05_ESP32 (MD1.35 P9.4), 06_LED_ARRAY (U6.3)